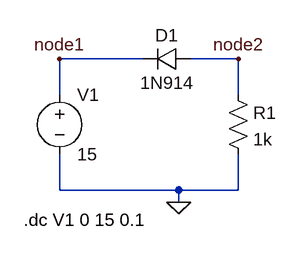
[diagram p0: schematic Draft13.asc]
Draft13.asc, the LTspice schematic file:
Version 4
SHEET 1 880 680
WIRE 112 96 0 96
WIRE 240 96 176 96
WIRE 0 144 0 96
WIRE 240 144 240 96
WIRE 0 272 0 224
WIRE 160 272 0 272
WIRE 240 272 240 224
WIRE 240 272 160 272
WIRE 160 288 160 272
FLAG 160 288 0
FLAG 240 96 node2
FLAG 0 96 node1
SYMBOL voltage 0 128 R0
WINDOW 123 0 0 Left 0
WINDOW 39 0 0 Left 0
SYMATTR InstName V1
SYMATTR Value 15
SYMBOL diode 176 80 R90
WINDOW 0 0 32 VBottom 2
WINDOW 3 32 32 VTop 2
SYMATTR InstName D1
SYMATTR Value 1N914
SYMBOL res 224 128 R0
SYMATTR InstName R1
SYMATTR Value 1k
TEXT -48 312 Left 2 !.dc V1 0 15 0.1

The netlist it stands for:
* Draft13.asc
V1 node1 0 15
D1 node2 node1 1N914
R1 node2 0 1k
.model D D
.lib standard.dio
.dc V1 0 15 0.1
.backanno
.end